# EAGLE schematic CargadorRpi (EAGLE 9.3.0)
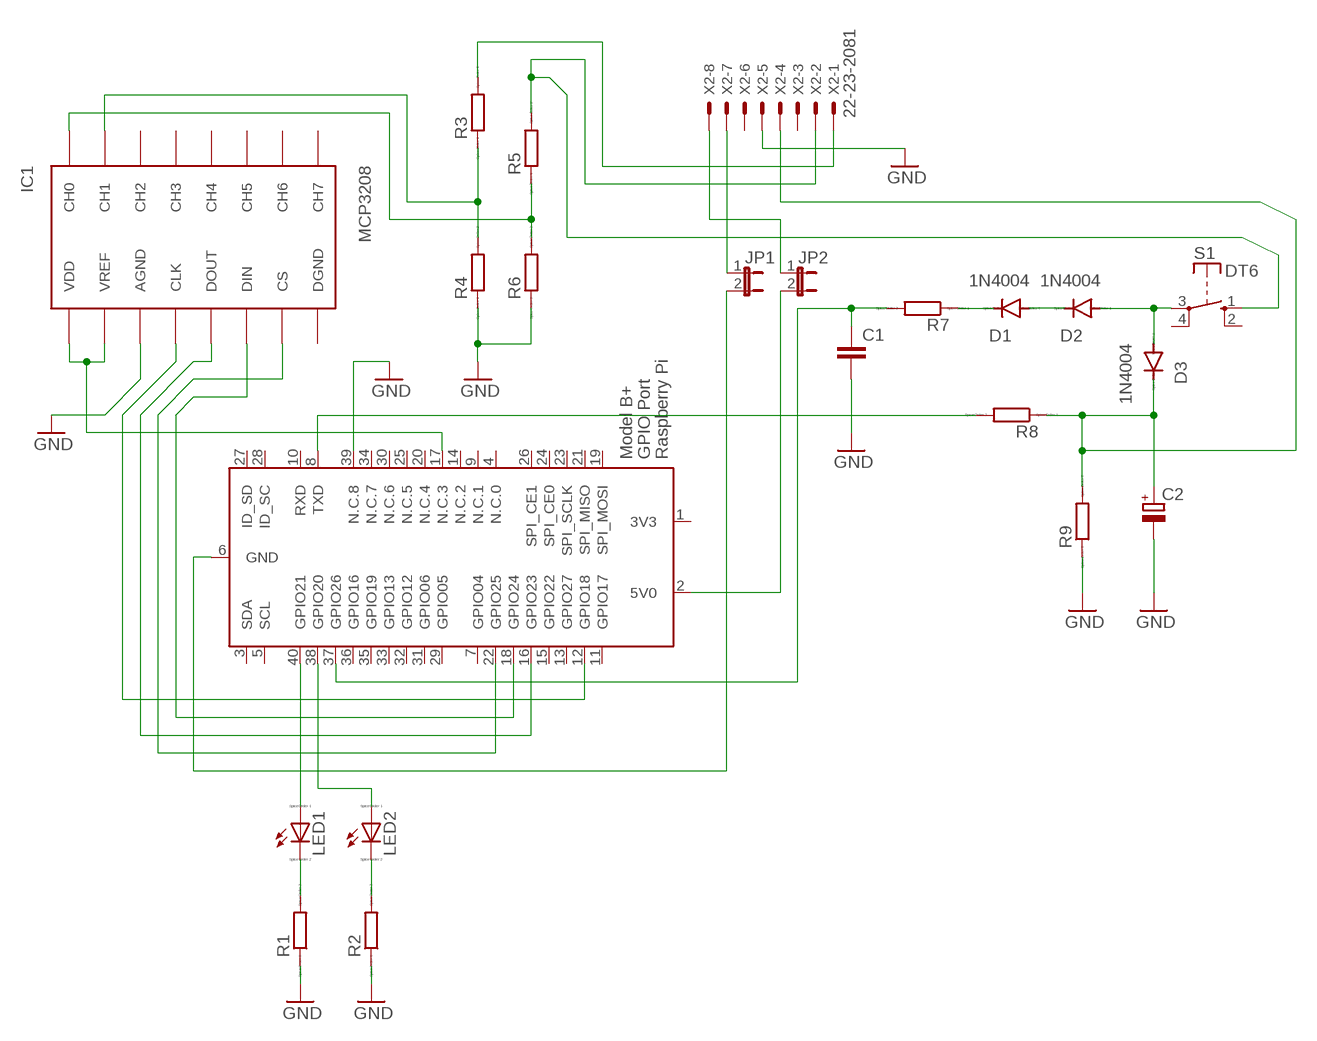
[diagram p0: schematic, sheet 1]

## Parts
C1  C2.5/2  [C2.5-2]
C2  CPOL-EUE5-4  [E5-4]
D1  1N4004  [DO41-10]
D2  1N4004  [DO41-10]
D3  1N4004  [DO41-10]
IC1  MCP3208  [DIL16]
JP1  JP1E  [JP1]
JP2  JP1E  [JP1]
LED1  LED_ELD260  [LED_LD260]
LED2  LED_ELD260  [LED_LD260]
R1  R  [R0805]
R2  R  [R0805]
R3  R  [R0805]
R4  R  [R0805]
R5  R  [R0805]
R6  R  [R0805]
R7  R  [R0805]
R8  R  [R0805]
R9  R  [R0805]
S1  DT6  [DT6]
X1  RASPI_GPIO_B+_PIN  [RASPI_GPIO_B+_PIN]
X2  22-23-2081  [22-23-2081]

## Nets
GND: C1.2 C2.- IC1.AGND R1.1 R2.1 R4.1 R6.1 R9.1 X1.39(N.C.8) X2.5
N$1: LED1.K(C) R1.2
N$2: LED2.K(C) R2.2
N$3: LED1.A X1.40(GPIO21)
N$4: LED2.A X1.38(GPIO20)
N$5: IC1.CS X1.22(GPIO25)
N$6: IC1.DOUT X1.16(GPIO23)
N$7: IC1.DIN X1.18(GPIO24)
N$8: IC1.CLK X1.12(GPIO18)
N$9: IC1.VDD IC1.VREF X1.17(N.C.3)
N$10: IC1.CH1 R3.1 R4.2
N$11: IC1.CH0 R5.1 R6.2
N$12: R3.2 X2.1
N$13: R5.2 S1.1(S) X2.2
N$14: JP1.1 X2.7
N$15: JP1.2 X1.6(GND)
N$16: JP2.1 X2.8
N$17: JP2.2 X1.2(5V0)
N$18: C1.1 R7.2 X1.37(GPIO26)
N$19: D1.C R7.1
N$20: D1.A D2.C
N$21: D2.A D3.A S1.3(P)
N$22: C2.+ D3.C R8.1 R9.2 X2.4
N$24: R8.2 X1.8(TXD)
Unconnected: IC1.CH2 IC1.CH3 IC1.CH4 IC1.CH5 IC1.CH6 IC1.CH7 S1.2(S) S1.4(P) X1.3(SDA) X1.4(N.C.0) X1.5(SCL) X1.7(GPIO04) X1.9(N.C.1) X1.10(RXD) X1.11(GPIO17) X1.13(GPIO27) X1.14(N.C.2) X1.15(GPIO22) X1.19(SPI_MOSI) X1.20(N.C.4) X1.21(SPI_MISO) X1.23(SPI_SCLK) X1.24(SPI_CE0) X1.25(N.C.5) X1.26(SPI_CE1) X1.27(ID_SD) X1.28(ID_SC) X1.29(GPIO05) X1.30(N.C.6) X1.31(GPIO06) X1.32(GPIO12) X1.33(GPIO13) X1.34(N.C.7) X1.35(GPIO19) X1.36(GPIO16) X2.3 X2.6

## Power pins joined to a net without a drawn wire
3V3: X1.1(3V3)
DGND: IC1.DGND

## Library data of the parts
C1 = capacitor-wima:C: CAPACITOR naming: grid - package width
C2 = rcl:CPOL-EU: POLARIZED CAPACITOR, European symbol; SPICEPREFIX: C
D1-D3 = diode:1N4004: DIODE general purpose rectifier, 1 A
IC1 = mcp3208:MCP3208
JP1 JP2 = jumper:JP1E: JUMPER
LED1 LED2 = eagle-ltspice:LED_E: LED Source: http://www.osram.convergy.de Source: www.luxeon.com Source: www.kingbright.com; SPICEMODEL: NONE; SPICEPREFIX: D; SPICETYPE: diode
R1-R9 = eagle-ltspice:R: RESISTOR, European symbol; SPICEMODEL: NONE; SPICEPREFIX: R
S1 = switch-misc:DT: ITT SWITCH
X1 = raspberrypi_bastelstube_v13:RASPI_GPIO_B+: Only the 2x20 header connector, nothing else
X2 = con-molex:22-23-2081: .100" (2.54mm) Center Header - 8 Pin; MF: MOLEX; MPN: 22-23-2081; OC_FARNELL: 1756826; OC_NEWARK: 01C7592